# Altium project Motor_Driver_MK_I.PrjPcb
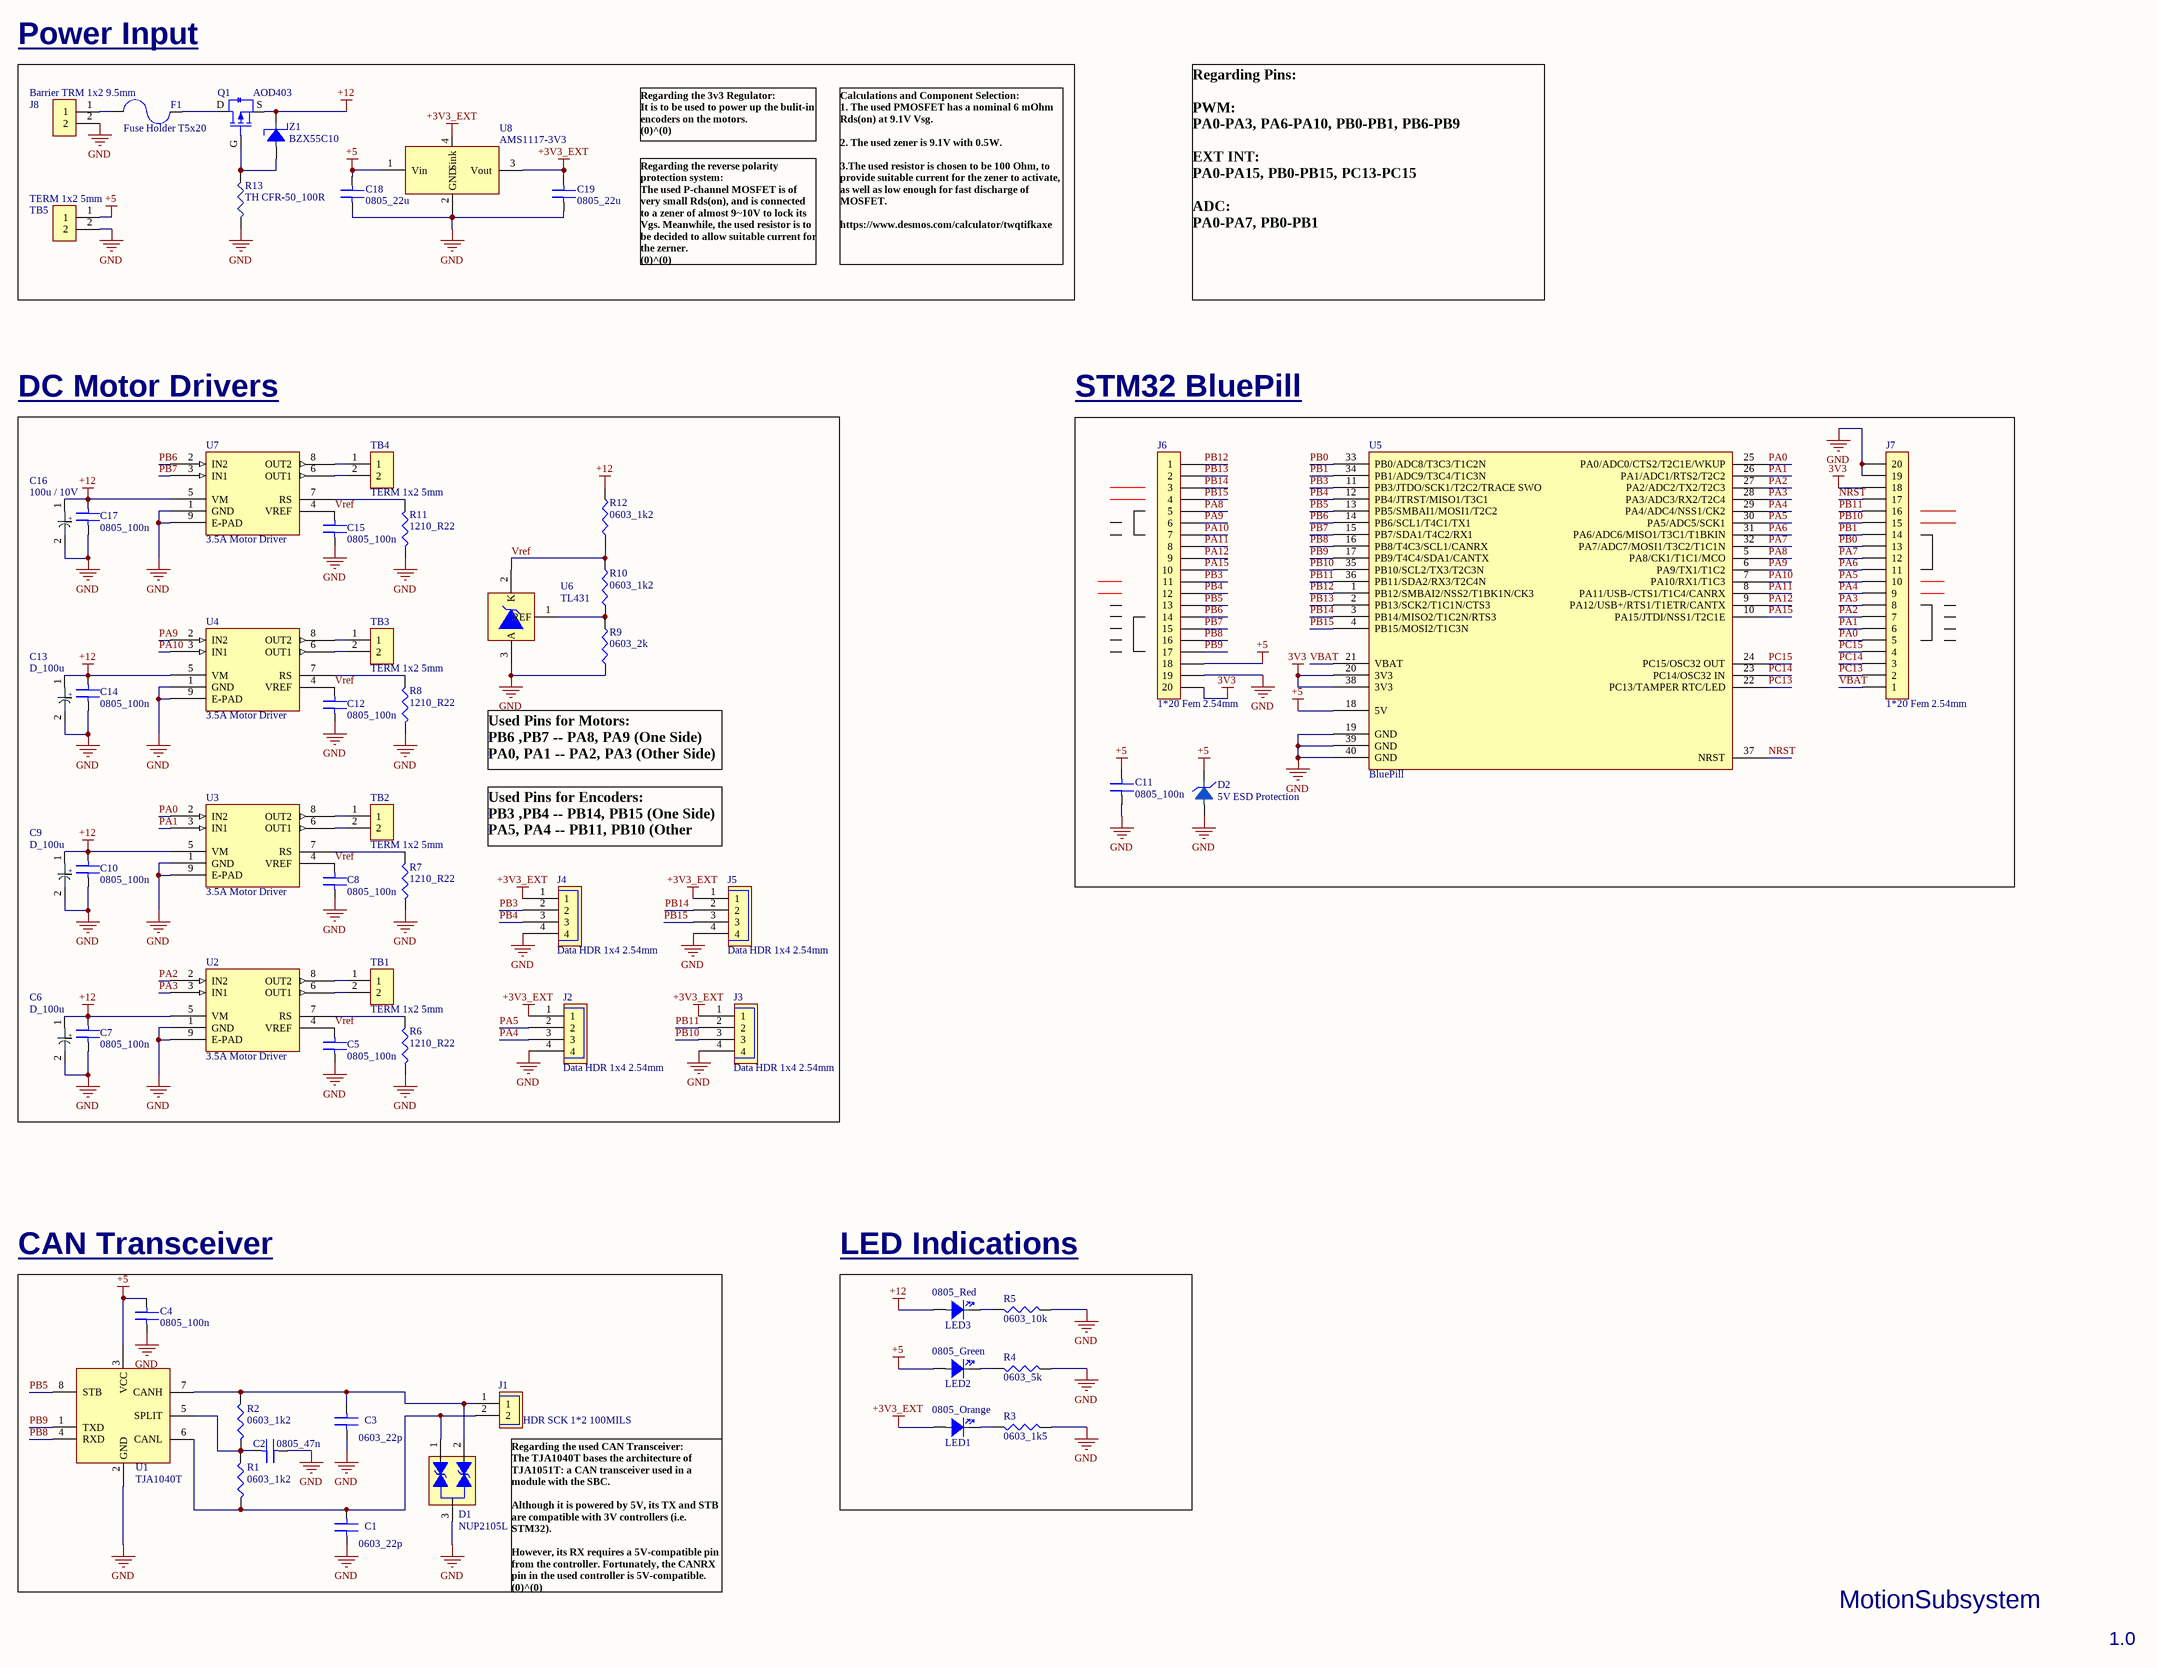
[diagram p0: Motor_Schem_1.SchDoc]
1 sheet, 61 parts. Net scope: global (net labels, ports and power ports of the same name join across sheets).
Board file: Motor_PCB_1.PcbDoc

## Sheet Motor_Schem_1.SchDoc
size C; SheetNumber: 1; SheetTotal: 1

### Parts
C1  0603_22p  [0603_CAP]
C2  0805_47n  [C0805 - 0.1uf]
C3  0603_22p  [0603_CAP]
C4  0805_100n  [C0805 - 0.1uf]
C5  0805_100n  [C0805 - 0.1uf]
C6  D_100u  [C_ALUM_D_SIZE]
C7  0805_100n  [C0805 - 0.1uf]
C8  0805_100n  [C0805 - 0.1uf]
C9  D_100u  [C_ALUM_D_SIZE]
C10  0805_100n  [C0805 - 0.1uf]
C11  0805_100n  [C0805 - 10uf]
C12  0805_100n  [C0805 - 0.1uf]
C13  D_100u  [C_ALUM_D_SIZE]
C14  0805_100n  [C0805 - 0.1uf]
C15  0805_100n  [C0805 - 0.1uf]
C16  100u / 10V  [C_ALUM_D_SIZE]
C17  0805_100n  [C0805 - 0.1uf]
C18  0805_22u  [C0805 - 0.1uf]
C19  0805_22u  [C0805 - 0.1uf]
D1  NUP2105L  [SO-23]
D2  5V ESD Protection  [D0-214AA]
F1  Fuse Holder T5x20  [FUSE]
J1  HDR SCK 1*2 100MILS  [DHDR 1*2 2,54MM]
J2  Data HDR 1x4 2.54mm  [DHDR_1x4_2.54mm]
J3  Data HDR 1x4 2.54mm  [DHDR_1x4_2.54mm]
J4  Data HDR 1x4 2.54mm  [DHDR_1x4_2.54mm]
J5  Data HDR 1x4 2.54mm  [DHDR_1x4_2.54mm]
J6  1*20 Fem 2.54mm  [20*1 FEM 2.54mm]
J7  1*20 Fem 2.54mm  [20*1 FEM 2.54mm]
J8  Barrier TRM 1x2 9.5mm  [BARRIER_9.5MM]
LED1  0805_Orange  [0805_LED]
LED2  0805_Green  [0805_LED]
LED3  0805_Red  [0805_LED]
Q1  AOD403  [DPAK]
R1  0603_1k2  [0603_CAP]
R2  0603_1k2  [0603_CAP]
R3  0603_1k5  [0603_CAP]
R4  0603_5k  [0603_CAP]
R5  0603_10k  [0603_CAP]
R6  1210_R22  [1210_R]
R7  1210_R22  [1210_R]
R8  1210_R22  [1210_R]
R9  0603_2k  [0603_CAP]
R10  0603_1k2  [0603_CAP]
R11  1210_R22  [1210_R]
R12  0603_1k2  [0603_CAP]
R13  TH CFR-50_100R  [R_THT_CFR-50]
TB1  TERM 1x2 5mm  [Terminal_5mm]
TB2  TERM 1x2 5mm  [Terminal_5mm]
TB3  TERM 1x2 5mm  [Terminal_5mm]
TB4  TERM 1x2 5mm  [Terminal_5mm]
TB5  TERM 1x2 5mm  [Terminal_5mm]
U1  TJA1040T  [SOP8 - duplicate]
U2  3.5A Motor Driver  [HSOP8]
U3  3.5A Motor Driver  [HSOP8]
U4  3.5A Motor Driver  [HSOP8]
U5  BluePill  [BluePill]
U6  TL431  [SO-23]
U7  3.5A Motor Driver  [HSOP8]
U8  AMS1117-3V3  [SOT-223]
Z1  BZX55C10  [DO-35]

### Blocks framed on the sheet
DC Motor Drivers: C5-C10 C12-C17 J2-J5 R6-R12 TB1-TB4 U2-U4 U6 U7
STM32 BluePill: C11 D2 J6 J7 U5
CAN Transceiver: C1-C4 D1 J1 R1 R2 U1
LED Indications: LED1-LED3 R3-R5

### Nets
3V3: J6.20 J7.18 U5.20(3V3) U5.38(3V3)
+3V3_EXT: C19.2 J2.1 J3.1 J4.1 J5.1 LED1.1(Anode) U8.3(Vout) U8.4(Sink)
+5: C4.2 C11.2 C18.2 D2.K(Cathode) J6.18 LED2.1(Anode) TB5.1 U1.3(VCC) U5.18(5V) U8.1(Vin)
+12: C6.1 C7.2 C9.1 C10.2 C13.1 C14.2 C16.1 C17.2 LED3.1(Anode) Q1.S R12.1 U2.5(VM) U3.5(VM) U4.5(VM) U7.5(VM) Z1.K(Cathode)
GND: C1.1 C2.1 C3.1 C4.1 C5.1 C6.2 C7.1 C8.1 C9.2 C10.1 C11.1 C12.1 C13.2 C14.1 C15.1 C16.2 C17.1 C18.1 C19.1 D1.3(IN3) D2.A(Anode) J2.4 J3.4 J4.4 J5.4 J6.19 J7.19 J7.20 J8.2 R3.1 R4.1 R5.1 R6.1 R7.1 R8.1 R9.1 R11.1 R13.1 TB5.2 U1.2(GND) U2.1(GND) U2.9(E-PAD) U3.1(GND) U3.9(E-PAD) U4.1(GND) U4.9(E-PAD) U5.19(GND) U5.39(GND) U5.40(GND) U6.3(A) U7.1(GND) U7.9(E-PAD) U8.2(GND)
NRST: J7.17 U5.37(NRST)
PA0: J7.5 U3.2(IN2) U5.25(PA0/ADC0/CTS2/T2C1E/WKUP)
PA1: J7.6 U3.3(IN1) U5.26(PA1/ADC1/RTS2/T2C2)
PA2: J7.7 U2.2(IN2) U5.27(PA2/ADC2/TX2/T2C3)
PA3: J7.8 U2.3(IN1) U5.28(PA3/ADC3/RX2/T2C4)
PA4: J2.3 J7.9 U5.29(PA4/ADC4/NSS1/CK2)
PA5: J2.2 J7.10 U5.30(PA5/ADC5/SCK1)
PA6: J7.11 U5.31(PA6/ADC6/MISO1/T3C1/T1BKIN)
PA7: J7.12 U5.32(PA7/ADC7/MOSI1/T3C2/T1C1N)
PA8: J6.5 U5.5(PA8/CK1/T1C1/MCO)
PA9: J6.6 U4.2(IN2) U5.6(PA9/TX1/T1C2)
PA10: J6.7 U4.3(IN1) U5.7(PA10/RX1/T1C3)
PA11: J6.8 U5.8(PA11/USB-/CTS1/T1C4/CANRX)
PA12: J6.9 U5.9(PA12/USB+/RTS1/T1ETR/CANTX)
PA15: J6.10 U5.10(PA15/JTDI/NSS1/T2C1E)
PB0: J7.13 U5.33(PB0/ADC8/T3C3/T1C2N)
PB1: J7.14 U5.34(PB1/ADC9/T3C4/T1C3N)
PB3: J4.2 J6.11 U5.11(PB3/JTDO/SCK1/T2C2/TRACE_SWO)
PB4: J4.3 J6.12 U5.12(PB4/JTRST/MISO1/T3C1)
PB5: J6.13 U1.8(STB) U5.13(PB5/SMBAI1/MOSI1/T2C2)
PB6: J6.14 U5.14(PB6/SCL1/T4C1/TX1) U7.2(IN2)
PB7: J6.15 U5.15(PB7/SDA1/T4C2/RX1) U7.3(IN1)
PB8: J6.16 U1.4(RXD) U5.16(PB8/T4C3/SCL1/CANRX)
PB9: J6.17 U1.1(TXD) U5.17(PB9/T4C4/SDA1/CANTX)
PB10: J3.3 J7.15 U5.35(PB10/SCL2/TX3/T2C3N)
PB11: J3.2 J7.16 U5.36(PB11/SDA2/RX3/T2C4N)
PB12: J6.1 U5.1(PB12/SMBAI2/NSS2/T1BK1N/CK3)
PB13: J6.2 U5.2(PB13/SCK2/T1C1N/CTS3)
PB14: J5.2 J6.3 U5.3(PB14/MISO2/T1C2N/RTS3)
PB15: J5.3 J6.4 U5.4(PB15/MOSI2/T1C3N)
PC13: J7.2 U5.22(PC13/TAMPER_RTC/LED)
PC14: J7.3 U5.23(PC14/OSC32_IN)
PC15: J7.4 U5.24(PC15/OSC32_OUT)
VBAT: J7.1 U5.21(VBAT)
Vref: C5.2 C8.2 C12.2 C15.2 R10.2 R12.2 U2.4(VREF) U3.4(VREF) U4.4(VREF) U6.2(K) U7.4(VREF)
NetC1_2: C1.2 D1.1(IN1) J1.2 R1.1 U1.6(CANL)
NetC2_2: C2.2 R1.2 R2.1 U1.5(SPLIT)
NetC3_2: C3.2 D1.2(IN2) J1.1 R2.2 U1.7(CANH)
NetF1_1: F1.1 J8.1
NetF1_2: F1.2 Q1.D
NetLED1_2: LED1.2(Cathode) R3.2
NetLED2_2: LED2.2(Cathode) R4.2
NetLED3_2: LED3.2(Cathode) R5.2
NetQ1_G: Q1.G R13.2 Z1.A(Anode)
NetR6_2: R6.2 U2.7(RS)
NetR7_2: R7.2 U3.7(RS)
NetR8_2: R8.2 U4.7(RS)
NetR9_2: R9.2 R10.1 U6.1(REF)
NetR11_2: R11.2 U7.7(RS)
NetTB1_1: TB1.1 U2.8(OUT2)
NetTB1_2: TB1.2 U2.6(OUT1)
NetTB2_1: TB2.1 U3.8(OUT2)
NetTB2_2: TB2.2 U3.6(OUT1)
NetTB3_1: TB3.1 U4.8(OUT2)
NetTB3_2: TB3.2 U4.6(OUT1)
NetTB4_1: TB4.1 U7.8(OUT2)
NetTB4_2: TB4.2 U7.6(OUT1)

### Notes on the sheet
- Power Input
- Regarding the 3v3 Regulator:
  It is to be used to power up the bulit-in encoders on the motors.
  (0)^(0)
- Regarding the reverse polarity protection system:
  The used P-channel MOSFET is of very small Rds(on), and is connected to a zener of almost 9~10V to lock its Vgs. Meanwhile, the used resistor is to be decided to allow suitable current for the zerner.
  (0)^(0)
- Calculations and Component Selection:
  1. The used PMOSFET has a nominal 6 mOhm Rds(on) at 9.1V Vsg.
  2. The used zener is 9.1V with 0.5W.
  3.The used resistor is chosen to be 100 Ohm, to provide suitable current for the zener to activate, as well as low enough for fast discharge of MOSFET.
  https://www.desmos.com/calculator/twqtifkaxe
- Regarding Pins:
  PWM:
  PA0-PA3, PA6-PA10, PB0-PB1, PB6-PB9
  EXT INT:
  PA0-PA15, PB0-PB15, PC13-PC15
  ADC:
  PA0-PA7, PB0-PB1
- Used Pins for Motors:
  PB6 ,PB7 -- PA8, PA9 (One Side)
  PA0, PA1 -- PA2, PA3 (Other Side)
- Used Pins for Encoders:
  PB3 ,PB4 -- PB14, PB15 (One Side)
  PA5, PA4 -- PB11, PB10 (Other Side)
- (near J1) Regarding the used CAN Transceiver:
  The TJA1040T bases the architecture of TJA1051T: a CAN transceiver used in a module with the SBC.
  Although it is powered by 5V, its TX and STB are compatible with 3V controllers (i.e. STM32).
  However, its RX requires a 5V-compatible pin from the controller. Fortunately, the CANRX pin in the used controller is 5V-compatible.
  (0)^(0)
- MotionSubsystem
- 1.0
- (in symbol EEE-1AA101WR) +

### Library data of the parts
C1 C3 = 0603 Capacitor
C2 C4 C5 C7 C8 C10 C12 C14 C15 C17-C19 = C2012X5R1E105K125AA: TDK - C2012X5R1E105K125AA - SMD Multilayer Ceramic Capacitor, 1 µF, 25 V, 0805 [2012 Metric], ± 10%, X5R, C Series; Capacitance: 1uF; Voltage Rating: 25V; Parameter Name 1: Tape and Reel; Supplier 1: Digi-Key; Manufacturer 1: TDK; Manufacturer Part Number 1: C2012X5R1E105K125AA; Stock 1: 16168; Pricing 1: 1=0.23000, 10=0.15800, 50=0.09500, 100=0.08030, 500=0.05492, 1000=0.04858 (USD); RoHS: Yes; Mount: Surface Mount; Case/Package: 0805; Number of Pins: 2; Weight: 0.000194oz; Case Code (Metric): 2012; Case Code (Imperial): 0805; Dielectric Material: Ceramic; Min Operating Temperature: -55°C; Max Operating Temperature: 85°C; Voltage Rating (DC): 25V; Termination: SMD/SMT; Dielectric: X5R; Tolerance: 10%; Package Quantity: 2000; Resistor Type: Ceramic; Voltage: 25V; Length: 2mm; Height: 1.25mm; Depth: 1.25mm; Width: 0.049inch; Thickness: 0.057inch; Radiation Hardening: No; Lead Free: Lead Free; REACH SVHC: No SVHC; ComponentLink1URL: https://datasheet.ciiva.com/11787/0900766b80c1bb00-11787608.pdf?src-supplier=RSComponents; ComponentLink1Description: https://datasheet.ciiva.com/11787/0900766b80c1bb00-11787608.pdf?src-supplier=RSComponents; ComponentLink2URL: https://datasheet.ciiva.com/16449/e412-c-16449595.pdf?src-supplier=Future+Electronics; ComponentLink2Description: https://datasheet.ciiva.com/16449/e412-c-16449595.pdf?src-supplier=Future+Electronics; ComponentLink3URL: https://datasheet.ciiva.com/28602/1744655-28602171.pdf?src-supplier=Element14; ComponentLink3Description: https://datasheet.ciiva.com/28602/1744655-28602171.pdf?src-supplier=Element14; ComponentLink4URL: https://datasheet.ciiva.com/15192/getdatasheetpartid-726707-15192140.pdf?src-supplier=Verical; ComponentLink4Description: https://datasheet.ciiva.com/15192/getdatasheetpartid-726707-15192140.pdf?src-supplier=Verical; Supplier Part Number 1: 445-1419-1-ND
C6 C9 C13 C16 = EEE-1AA101WR: Cap Aluminum 100uF 10V 20% (5 X 5.4mm) SMD 50mA 1000 hr 85°C T/R; Manufacturer 1: Panasonic; Parameter Name 1: Tape and Reel; Life (Hours): 1000Hour; Supplier 1: Digi-Key; Manufacturer Part Number 1: EEE-1AA101WR; Stock 1: 0; Pricing 1: 1=0.34000, 10=0.23100, 50=0.15400, 100=0.13090, 500=0.09240 (USD); RoHS: Yes; Mount: Surface Mount,PCB; Case/Package: Radial; Contact Plating: Tin; Min Operating Temperature: -40°C; Max Operating Temperature: 85°C; Capacitance: 100uF; Voltage Rating: 10V; Tolerance: 20%; Ripple Current: 50mA; Package Quantity: 1; Ripple Current (AC): 50mA; Voltage Rating (DC): 10V; Termination: SMD/SMT; Diameter: 5mm; Length: 5.5mm; Height: 5.4mm; Height - Seated (Max): 0.213inch; Radiation Hardening: No; REACH SVHC: Unknown; Lead Free: Lead Free; ComponentLink1URL: https://datasheet.ciiva.com/26945/getdatasheetpartid-169213-26945071.pdf?src-supplier=Verical; ComponentLink1Description: https://datasheet.ciiva.com/26945/getdatasheetpartid-169213-26945071.pdf?src-supplier=Verical; ComponentLink2URL: https://datasheet.ciiva.com/2983/aba0000ce2-2983906.pdf?src-supplier=Avnet; ComponentLink2Description: https://datasheet.ciiva.com/2983/aba0000ce2-2983906.pdf?src-supplier=Avnet; ComponentLink3URL: https://datasheet.ciiva.com/30075/11aba0000ce2-30075303.pdf?src-supplier=Onlinecomponents.com; ComponentLink3Description: https://datasheet.ciiva.com/30075/11aba0000ce2-30075303.pdf?src-supplier=Onlinecomponents.com; ComponentLink4URL: https://datasheet.ciiva.com/16427/aba0000ce2-16427544.pdf?src-supplier=Future+Electronics; ComponentLink4Description: https://datasheet.ciiva.com/16427/aba0000ce2-16427544.pdf?src-supplier=Future+Electronics; ComponentLink5URL: https://datasheet.ciiva.com/14598/70255710-14598233.pdf?src-supplier=Allied+Electronics; ComponentLink5Description: https://datasheet.ciiva.com/14598/70255710-14598233.pdf?src-supplier=Allied+Electronics; ComponentLink6URL: https://datasheet.ciiva.com/14605/70255710-14605689.pdf?src-supplier=Allied+Electronics; ComponentLink6Description: https://datasheet.ciiva.com/14605/70255710-14605689.pdf?src-supplier=Allied+Electronics; ComponentLink7URL: https://datasheet.ciiva.com/11673/aba0000ce2-11673882.pdf?src-supplier=Avnet; ComponentLink7Description: https://datasheet.ciiva.com/11673/aba0000ce2-11673882.pdf?src-supplier=Avnet; ComponentLink8URL: https://datasheet.ciiva.com/24027/aba0000ce2-40801-24027541.pdf?src-supplier=Mouser; ComponentLink8Description: https://datasheet.ciiva.com/24027/aba0000ce2-40801-24027541.pdf?src-supplier=Mouser; Supplier Part Number 1: PCE3867CT-ND
C11 = C2012X5R1C106K085AC: TDK - C2012X5R1C106K085AC - SMD Multilayer Ceramic Capacitor, 10 µF, 16 V, 0805 [2012 Metric], ± 10%, X5R, C Series TDK; Capacitance: 10uF; Voltage Rating: 16V; Parameter Name: Tape and Reel; Supplier 1: Digi-Key; Manufacturer 1: TDK; Manufacturer Part Number 1: C2012X5R1C106K085AC; Stock 1: 1313952; Pricing 1: 1=0.24000, 10=0.16700, 50=0.11140, 100=0.09460, 500=0.06680, 1000=0.05844 (USD); RoHS: Yes; Mount: Surface Mount; Case/Package: 0805; Number of Pins: 2; Weight: 0.000194oz; Case Code (Metric): 2012; Case Code (Imperial): 0805; Dielectric Material: Ceramic; Min Operating Temperature: -55°C; Max Operating Temperature: 85°C; Tolerance: 10%; Voltage Rating (DC): 16V; Termination: SMD/SMT; Dielectric: X5R; Package Quantity: 1; Resistor Type: Ceramic; Length: 2mm; Height: 0.85mm; Depth: 1.25mm; Width: 0.049inch; Thickness: 0.037inch; Lead Free: Lead Free; REACH SVHC: No SVHC; ComponentLink1URL: https://datasheet.ciiva.com/24218/c2012x5r1c106k085ac-264980-24218056.pdf?src-supplier=Mouser; ComponentLink1Description: https://datasheet.ciiva.com/24218/c2012x5r1c106k085ac-264980-24218056.pdf?src-supplier=Mouser; ComponentLink2URL: https://datasheet.ciiva.com/28451/1796654-28451610.pdf?src-supplier=Element14; ComponentLink2Description: https://datasheet.ciiva.com/28451/1796654-28451610.pdf?src-supplier=Element14; ComponentLink3URL: https://datasheet.ciiva.com/28602/1744655-28602170.pdf?src-supplier=Element14; ComponentLink3Description: https://datasheet.ciiva.com/28602/1744655-28602170.pdf?src-supplier=Element14; ComponentLink4URL: https://datasheet.ciiva.com/6259/tdkmlcccaprange-6259116.pdf?src-supplier=Digi-Key; ComponentLink4Description: https://datasheet.ciiva.com/6259/tdkmlcccaprange-6259116.pdf?src-supplier=Digi-Key; ComponentLink5URL: https://datasheet.ciiva.com/23803/1796654-23803020.pdf?src-supplier=Newark; ComponentLink5Description: https://datasheet.ciiva.com/23803/1796654-23803020.pdf?src-supplier=Newark; ComponentLink6URL: https://datasheet.ciiva.com/22719/1796654-22719549.pdf?src-supplier=Element14; ComponentLink6Description: https://datasheet.ciiva.com/22719/1796654-22719549.pdf?src-supplier=Element14; ComponentLink7URL: https://datasheet.ciiva.com/6259/tdkmlcccaprange-6259119.pdf?src-supplier=Digi-Key; ComponentLink7Description: https://datasheet.ciiva.com/6259/tdkmlcccaprange-6259119.pdf?src-supplier=Digi-Key; ComponentLink8URL: https://datasheet.ciiva.com/28673/mlcc-commercial-general-en-28673535.pdf?src-supplier=Element14; ComponentLink8Description: https://datasheet.ciiva.com/28673/mlcc-commercial-general-en-28673535.pdf?src-supplier=Element14; Supplier Part Number 1: 445-7644-1-ND
D1 = NUP2105L: ESD Protection Dual Diode for CAN Bus Line Protection
D2 = SMBJ5.0A
F1 = FUSE_T5x20
J1 = 2-Pin Data Connector: Conn Shrouded Header HDR 2 POS 2.54mm Solder ST Thru-Hole; Manufacturer 1: TE Connectivity; Manufacturer Part Number 1: 2-644861-2; Underplate Material: Nickel; Number of Contacts: 2; Connector Type: Plug,Header,Pin; Voltage Rating: 250V; Mating Alignment: Yes (With); PCB Mount Retention: Without; PCB Mounting Orientation: Vertical; Gender: Male; Current Rating: 5A; Contact Resistance: 6mR; Contact Retention: No (Without); Connector System: Wire-to-Board; Contact Style: Straight; Contact Post Length: 3.56mm; Plating Thickness: 6.3um; PCB Thickness: 0.063inch; Approvals: CSA; Supplier 1: Digi-Key; Stock 1: 3206; Pricing 1: 1=0.41000, 10=0.39200, 100=0.27420, 500=0.23506, 1000=0.19588, 5000=0.16790, 10000=0.15670 (USD); RoHS: Yes; Mount: Through Hole; Housing Color: Black; Contact Plating: Tin,Matte; Contact Material: Copper Alloy; Housing Material: Polyester; Color: Black; Contact Shape: Square; Min Operating Temperature: -67°C; Max Operating Temperature: 221°C; Termination: Solder; Number of Rows: 1; Number of Positions: 2; Package Quantity: 500; Packaging: Bag; Contact Gender: Male; Orientation: Straight; Fastening Type: Friction; Max Voltage Rating (AC): 250V; Shrouded: Yes (With); Voltage Rating (AC): 250V; Mating Retention: Yes (With); PCB Mount Alignment: No (Without); Sealable: No (Without); Contact Current Rating: 5A; Strain Relief: No (Without); Backwall/Post Interruptions: No (Without); Length: 7.21mm; Height: 10.41mm; Pitch: 2.54mm; Contact Mating Length: 5.1mm; Depth: 7.95mm; Tail Length: 3.56mm; Radiation Hardening: No; Flammability Rating: UL94 V-0; ELV: Compliant; Lead Free: Lead Free; REACH SVHC: Unknown; ComponentLink1URL: https://datasheet.ciiva.com/16303/eng-ds-82056-mta-0608-16303634.pdf?src-supplier=Future+Electronics; ComponentLink1Description: https://datasheet.ciiva.com/16303/eng-ds-82056-mta-0608-16303634.pdf?src-supplier=Future+Electronics; ComponentLink2URL: https://datasheet.ciiva.com/30111/8852eng-ds-82056-mta-0608-30111398.pdf?src-supplier=Onlinecomponents.com; ComponentLink2Description: https://datasheet.ciiva.com/30111/8852eng-ds-82056-mta-0608-30111398.pdf?src-supplier=Onlinecomponents.com; ComponentLink3URL: https://datasheet.ciiva.com/709/eng-cd-644861-n-basefilename-709739.pdf?src-supplier=Digi-Key; ComponentLink3Description: https://datasheet.ciiva.com/709/eng-cd-644861-n-basefilename-709739.pdf?src-supplier=Digi-Key; ComponentLink4URL: https://datasheet.ciiva.com/3118/eng-ds-82056-mta-0608-3118126.pdf?src-supplier=Avnet; ComponentLink4Description: https://datasheet.ciiva.com/3118/eng-ds-82056-mta-0608-3118126.pdf?src-supplier=Avnet; Supplier Part Number 1: A30931-ND
J2-J5 = 4-Pin Data Connector: MTA-100 Series, 2.54mm Pitch 4 Way 1 RowStraight PCB Header, Solder Term, 5A; Manufacturer 1: TE Connectivity; Manufacturer Part Number 1: 2-644861-4; Underplate Material: Nickel; Number of Contacts: 4; Connector Type: Plug,Header,Pin; Voltage Rating: 250V; Gender: Male; Shrouded: Yes (With); PCB Mount Retention: Without; PCB Mounting Orientation: Vertical; Contact Resistance: 6mR; Backwall/Post Interruptions: No (Without); Connector System: Wire-to-Board; Contact Post Length: 3.56mm; Plating Thickness: 6.35um; PCB Thickness: 0.063inch; Approvals: CSA; Supplier 1: Digi-Key; Stock 1: 18767; Pricing 1: 1=0.79000, 10=0.74100, 100=0.56790, 500=0.49380, 1000=0.40739, 5000=0.35801, 10000=0.33332 (USD); RoHS: Yes; Mount: Through Hole; Housing Color: Black; Color: Black; Contact Material: Copper Alloy; Contact Plating: Tin,Matte; Housing Material: Polyester; Contact Shape: Square; Min Operating Temperature: -67°C; Max Operating Temperature: 221°C; Termination: Solder; Number of Rows: 1; Contact Gender: Male; Number of Positions: 4; Package Quantity: 500; Packaging: Loose Piece; Current Rating: 5A; Voltage Rating (AC): 250V; Mating Alignment: Yes (With); Orientation: Straight; Fastening Type: Friction; Max Voltage Rating (AC): 250V; Contact Current Rating: 5A; Contact Retention: No (Without); Mating Retention: Yes (With); PCB Mount Alignment: No (Without); Sealable: No (Without); Strain Relief: No (Without); Contact Style: Straight; Length: 12.29mm; Height: 10.41mm; Pitch: 2.54mm; Contact Mating Length: 5.1mm; Depth: 7.95mm; Tail Length: 3.56mm; Radiation Hardening: No; Flammability Rating: UL94 V-0; ELV: Compliant; Lead Free: Lead Free; REACH SVHC: Unknown; ComponentLink1URL: https://datasheet.ciiva.com/7800/1651878-7800290.pdf?src-supplier=Element14; ComponentLink1Description: https://datasheet.ciiva.com/7800/1651878-7800290.pdf?src-supplier=Element14; ComponentLink2URL: https://datasheet.ciiva.com/15175/getdatasheetpartid-36841-15175492.pdf?src-supplier=Verical; ComponentLink2Description: https://datasheet.ciiva.com/15175/getdatasheetpartid-36841-15175492.pdf?src-supplier=Verical; ComponentLink3URL: https://datasheet.ciiva.com/11759/0900766b80f915a0-11759930.pdf?src-supplier=RSComponents; ComponentLink3Description: https://datasheet.ciiva.com/11759/0900766b80f915a0-11759930.pdf?src-supplier=RSComponents; ComponentLink4URL: https://datasheet.ciiva.com/714/eng-cd-644861-n-basefilename-714593.pdf?src-supplier=Digi-Key; ComponentLink4Description: https://datasheet.ciiva.com/714/eng-cd-644861-n-basefilename-714593.pdf?src-supplier=Digi-Key; ComponentLink5URL: https://datasheet.ciiva.com/16684/eng-ds-82056-mta-0608-16684709.pdf?src-supplier=Avnet+Europe; ComponentLink5Description: https://datasheet.ciiva.com/16684/eng-ds-82056-mta-0608-16684709.pdf?src-supplier=Avnet+Europe; ComponentLink6URL: https://datasheet.ciiva.com/16497/eng-ds-82056-mta-0608-16497871.pdf?src-supplier=Avnet+Asia; ComponentLink6Description: https://datasheet.ciiva.com/16497/eng-ds-82056-mta-0608-16497871.pdf?src-supplier=Avnet+Asia; Supplier Part Number 1: A30933-ND
J8 = Barrier BLK: CONN BARRIER STRIP 2CIRC 0.374"; Manufacturer 1: On-Shore Technology; Manufacturer Part Number 1: OSTYK44102030; Current Rating: 30A; Voltage Rating: 300V; Parameter Name 1: Bulk; Number of Circuits: 2; Wire Gauge (Max): 22AWG; Wire Gauge (Min): 10AWG; Pitch: 0.374inch; Supplier 1: Digi-Key; Stock 1: 3505; Pricing 1: 1=1.22000, 10=0.76100, 25=0.65160, 50=0.58560, 100=0.57340, 250=0.48800, 500=0.46360, 1000=0.41480, 5000=0.32452 (USD); RoHS: Yes; Mount: Through Hole; Color: Black; Insulation Material: Nylon; Min Operating Temperature: -40°C; Max Operating Temperature: 105°C; Number of Rows: 1; Number of Wire Entries: 2; Flammability Rating: UL94 V-0; ComponentLink1URL: https://datasheet.ciiva.com/778/ostyk441xx030-778584.pdf?src-supplier=Digi-Key; ComponentLink1Description: https://datasheet.ciiva.com/778/ostyk441xx030-778584.pdf?src-supplier=Digi-Key; Supplier Part Number 1: ED2971-ND
LED1-LED3 = 0805LED
Q1 = AOD403: MOSFET Transistor P-Channel 30V 15A 3.5V @ 250uA 6mΩ @ 20A,20V 2.5W TO-252-2(DPAK)
R1-R5 R9 R10 R12 = 0603 Resistor
R6-R8 R11 = 1210 Resistor
R13 = TH CFR-50 Resis: General Type Carbon Film Resistor 330Ohm 1/2W 5% Axial Bulk; Manufacturer 1: Yageo; Manufacturer Part Number 1: CFR-50JB-52-330R; Temperature Coefficient: 500ppm/°C; Resistance: 330R; Max Power Dissipation: 500mW; Supplier 1: Digi-Key; Stock 1: 1637; Pricing 1: 1=0.11000, 10=0.09800, 25=0.06800, 50=0.05300, 100=0.03780, 250=0.02948, 500=0.02344, 1000=0.01663, 5000=0.01285 (USD); RoHS: Yes; Case/Package: Axial; Min Operating Temperature: -55°C; Max Operating Temperature: 155°C; Resistor Type: Carbon Film; Number of Terminations: 2; Package Quantity: 200; Packaging: Bulk; Tolerance: 5%; Length: 0.354inch; ComponentLink1URL: http://www.yageo.com/documents/recent/Yageo%20LR_CFR_2013.pdf?src-supplier=Digi-Key; ComponentLink1Description: http://www.yageo.com/documents/recent/Yageo%20LR_CFR_2013.pdf?src-supplier=Digi-Key
TB1-TB5 = Terminal BLK Green: PHOENIX CONTACT         MKDSN 1,5/ 2             Wire-To-Board Terminal Block, 5 mm, 2 Ways, 26 AWG, 16 AWG, 1.5 mm, Screw; Manufacturer Part Number 1: 1729018; Parameter Name 1: Bulk; Number of Positions: 2; Current Rating: 13.5A; Number of Levels: 1; Current: 10A; Gender: Male; Voltage Rating: 400V; Voltage: 300V; Max Supply Voltage: 250V; Wire Gauge (Max): 26AWG; Stripping Length: 6mm; Approvals: UL,CSA,cULus,CB; Supplier 1: Mouser; Manufacturer 1: Phoenix Contact; Stock 1: 6371; Pricing 1: 1=1.10000, 10=1.05000, 50=1.01000, 100=0.97400, 250=0.91000, 500=0.83800 (USD); RoHS: Yes; Mount: Through Hole; Number of Pins: 2; Weight: 0.06949oz; Color: Green; Material: Polyamide; Housing Material: Polyamide; Housing Color: Green; Contact Material: Tin; Insulation Material: Nylon; Package Quantity: 50; Termination: Screw; Number of Positions Per Level: 2; Number of Contacts: 2; Number of Circuits: 2; Connector Type: Screw; Orientation: Straight; Number of Rows: 1; Max Current Rating: 13.5A; Number of Poles: 2; Length: 8.1mm; Height: 13.5mm; Pitch: 5mm; Wire Gauge (Min): 26AWG; Depth: 8.1mm; Width: 13.5mm; Wire/Cable Gauge: 26AWG; Radiation Hardening: No; REACH SVHC: Unknown; Flammability Rating: UL94 V-0; Lead Free: Lead Free; ComponentLink1URL: https://datasheet.ciiva.com/16071/1729018-16071814.pdf?src-supplier=Onlinecomponents.com; ComponentLink1Description: https://datasheet.ciiva.com/16071/1729018-16071814.pdf?src-supplier=Onlinecomponents.com; ComponentLink2URL: https://datasheet.ciiva.com/832/1729018-832055.pdf?src-supplier=Digi-Key; ComponentLink2Description: https://datasheet.ciiva.com/832/1729018-832055.pdf?src-supplier=Digi-Key; ComponentLink3URL: https://datasheet.ciiva.com/15169/getdatasheetpartid-177860-15169643.pdf?src-supplier=Verical; ComponentLink3Description: https://datasheet.ciiva.com/15169/getdatasheetpartid-177860-15169643.pdf?src-supplier=Verical; ComponentLink4URL: https://datasheet.ciiva.com/14607/70054375-14607356.pdf?src-supplier=Allied+Electronics; ComponentLink4Description: https://datasheet.ciiva.com/14607/70054375-14607356.pdf?src-supplier=Allied+Electronics; ComponentLink5URL: https://datasheet.ciiva.com/33105/1729018-33105978.pdf?src-supplier=Today+Components; ComponentLink5Description: https://datasheet.ciiva.com/33105/1729018-33105978.pdf?src-supplier=Today+Components; Supplier Part Number 1: 651-1729018
U1 = TJA1040T: CAN Transceiver
U2-U4 U7 = TB67H450FNG
U5 = STM32 BluePill
U6 = TL431: SMD Voltage References SOT-23
U8 = AMS1117 - 3V3: AMS1117-3.3 Checked Fixed Positive LDO Regulator, 3.3V, 1.3V Dropout, PDSO3 Voltage Regulators - Linear
Z1 = Zener_DO-35: TH Zener Diode DO-35